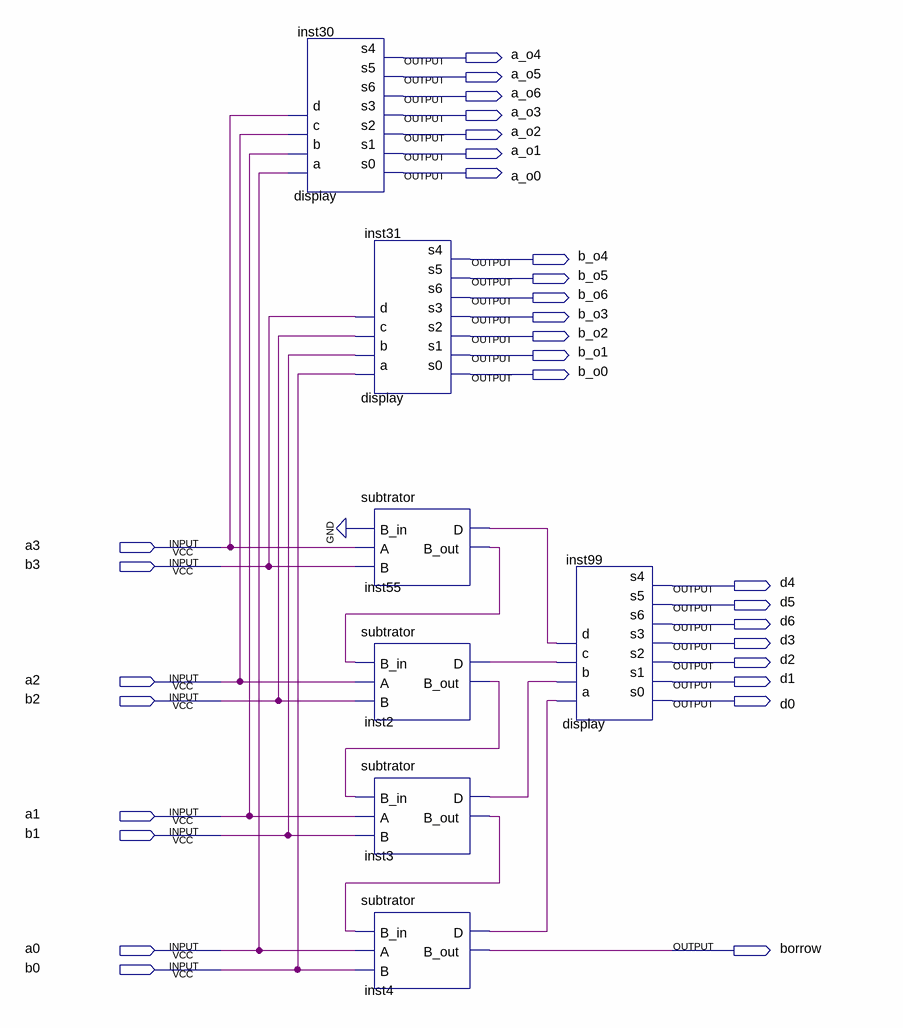
[diagram p0: schematic sheet]
// Quartus schematic aula08.bdf as structural Verilog: 7 symbols, 30 pins
module aula08 (
  input  a3,
  input  b3,
  input  a2,
  input  b2,
  input  a1,
  input  b1,
  input  a0,
  input  b0,
  output a_o4,
  output a_o5,
  output a_o6,
  output a_o3,
  output a_o2,
  output a_o1,
  output a_o0,
  output b_o4,
  output b_o5,
  output b_o6,
  output b_o3,
  output b_o2,
  output b_o1,
  output b_o0,
  output d4,
  output d5,
  output d6,
  output d3,
  output d2,
  output d1,
  output d0,
  output borrow
);

  wire inst2_b_out, inst2_d, inst3_b_out, inst3_d, inst4_d, inst55_b_out, inst55_d;

  display inst30 (
    .a(a0), .b(a1), .c(a2), .d(a3), .s0(a_o0), .s1(a_o1), .s2(a_o2), .s3(a_o3), .s6(a_o6), .s5(a_o5),
    .s4(a_o4));
  display inst31 (
    .a(b0), .b(b1), .c(b2), .d(b3), .s0(b_o0), .s1(b_o1), .s2(b_o2), .s3(b_o3), .s6(b_o6), .s5(b_o5),
    .s4(b_o4));
  subtrator inst55 (.B_in(1'b0), .A(a3), .B(b3), .D(inst55_d), .B_out(inst55_b_out));
  subtrator inst2 (.B_in(inst55_b_out), .A(a2), .B(b2), .D(inst2_d), .B_out(inst2_b_out));
  subtrator inst3 (.B_in(inst2_b_out), .A(a1), .B(b1), .D(inst3_d), .B_out(inst3_b_out));
  subtrator inst4 (.B_in(inst3_b_out), .A(a0), .B(b0), .D(inst4_d), .B_out(borrow));
  display inst99 (
    .a(inst4_d), .b(inst3_d), .c(inst2_d), .d(inst55_d), .s0(d0), .s1(d1), .s2(d2), .s3(d3), .s6(d6),
    .s5(d5), .s4(d4));
endmodule
